# EAGLE design podule_2040 (EAGLE 9.4.2)
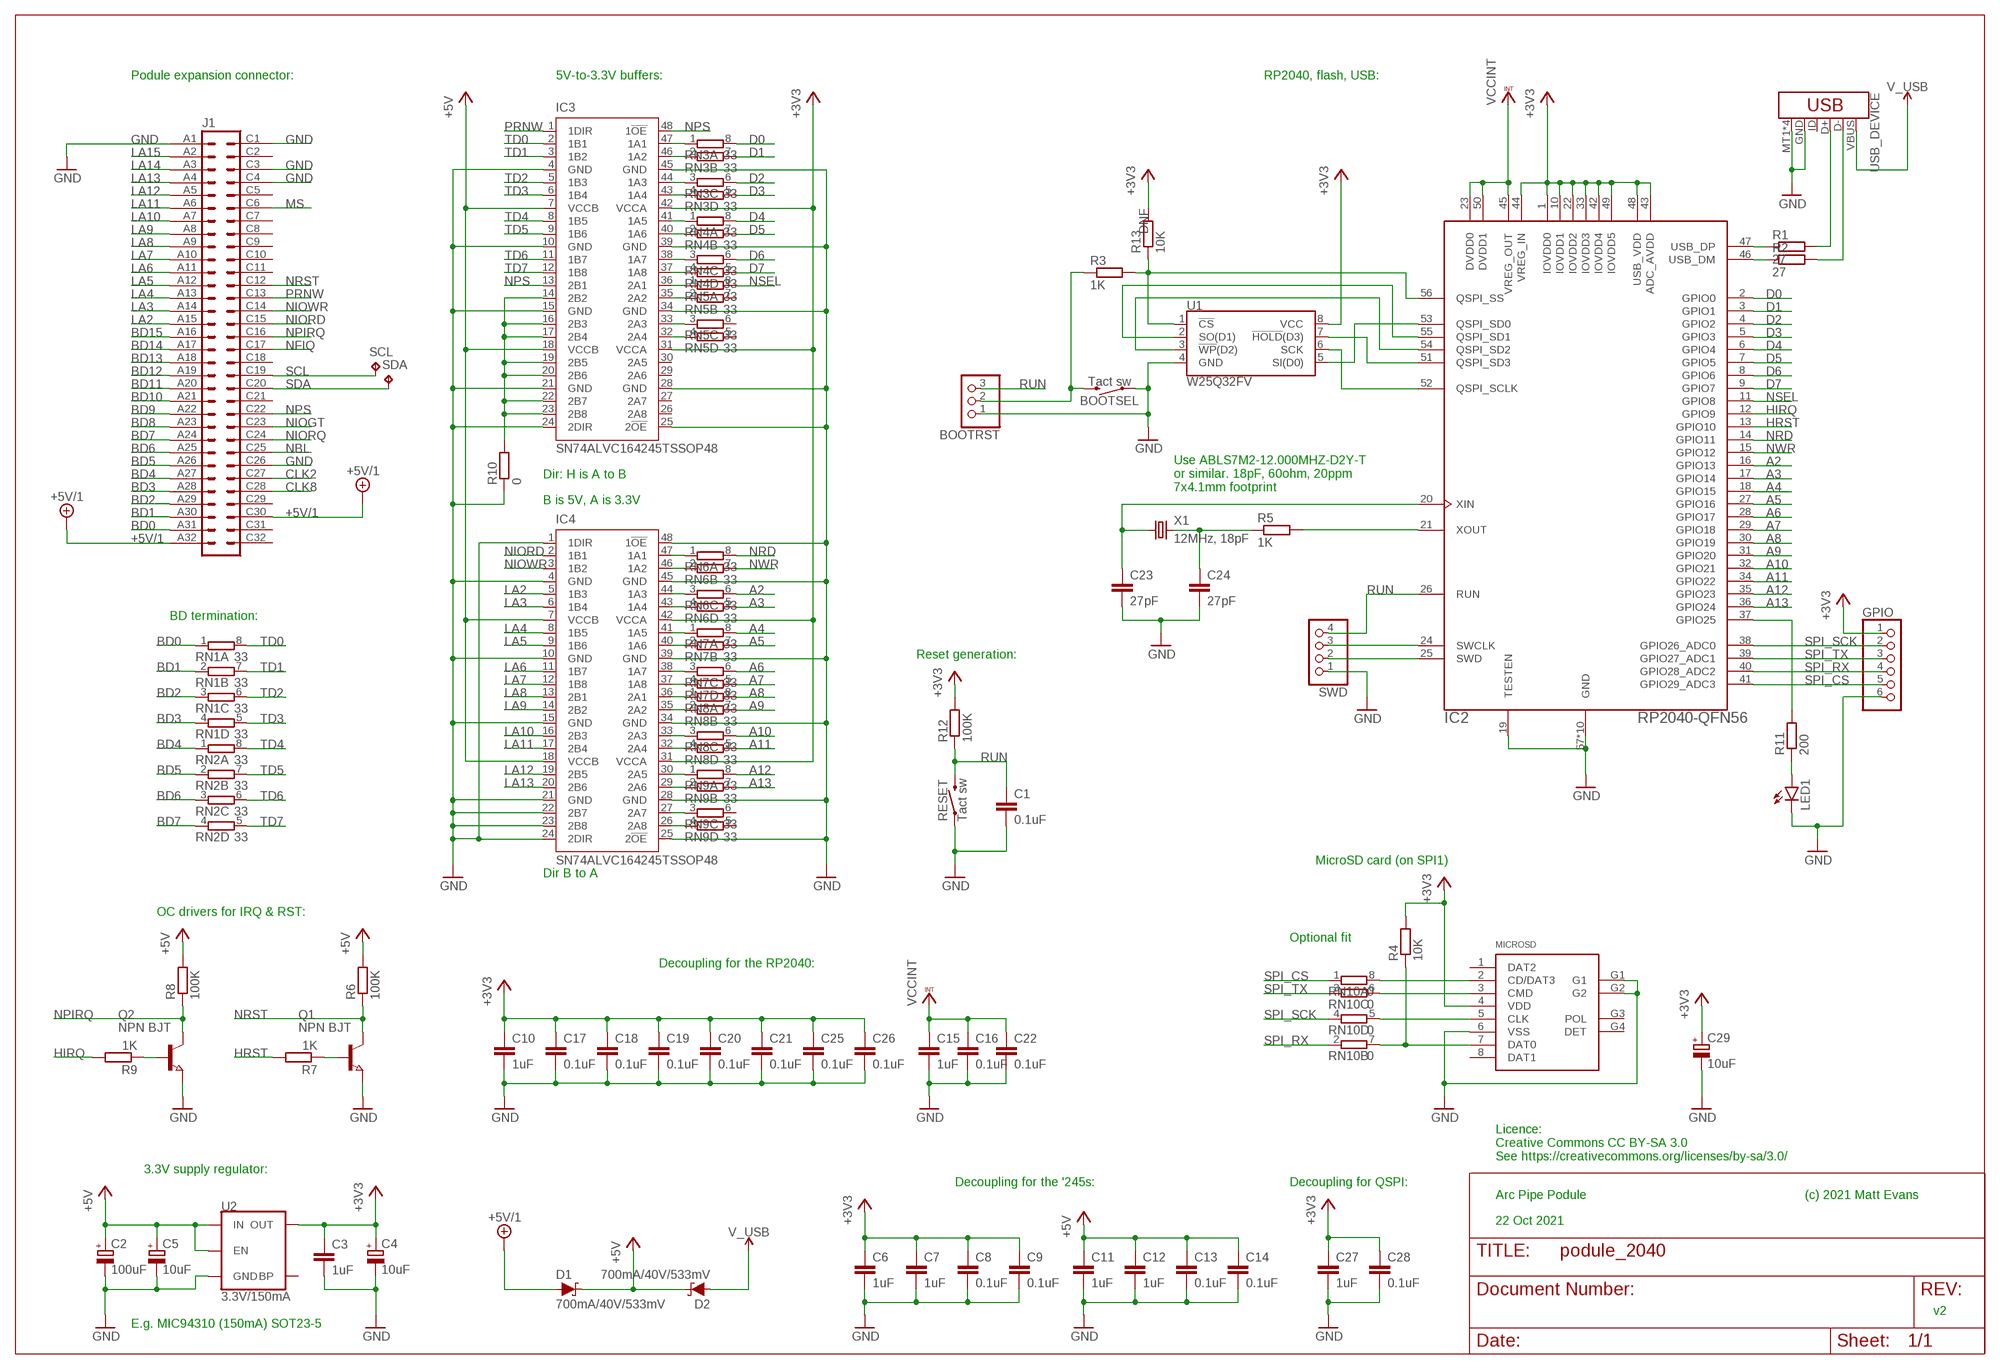
[diagram p0: schematic, sheet 1]

## Parts
BOOTRST  PINHD-1X3  [1X03]
BOOTSEL  Tact sw  MOMENTARY-SWITCH-SPST-SMD-5.2-REDUNDANT  [TACTILE_SWITCH_SMD_5.2MM]
C1  0.1uF  C-EUC0603K  [C0603K]
C2  100uF  CPOL-EUCT6032  [CT6032]
C3  1uF  C-EUC0603K  [C0603K]
C4  10uF  CPOL-EUA/3216-18W  [A/3216-18W]
C5  10uF  CPOL-EUA/3216-18W  [A/3216-18W]
C6  1uF  C-EUC0603K  [C0603K]
C7  1uF  C-EUC0603K  [C0603K]
C8  0.1uF  C-EUC0603K  [C0603K]
C9  0.1uF  C-EUC0603K  [C0603K]
C10  1uF  C-EUC0603K  [C0603K]
C11  1uF  C-EUC0603K  [C0603K]
C12  1uF  C-EUC0603K  [C0603K]
C13  0.1uF  C-EUC0603K  [C0603K]
C14  0.1uF  C-EUC0603K  [C0603K]
C15  1uF  C-EUC0603K  [C0603K]
C16  0.1uF  C-EUC0603K  [C0603K]
C17  0.1uF  C-EUC0603K  [C0603K]
C18  0.1uF  C-EUC0603K  [C0603K]
C19  0.1uF  C-EUC0603K  [C0603K]
C20  0.1uF  C-EUC0603K  [C0603K]
C21  0.1uF  C-EUC0603K  [C0603K]
C22  0.1uF  C-EUC0603K  [C0603K]
C23  27pF  C-EUC0603K  [C0603K]
C24  27pF  C-EUC0603K  [C0603K]
C25  0.1uF  C-EUC0603K  [C0603K]
C26  0.1uF  C-EUC0603K  [C0603K]
C27  1uF  C-EUC0603K  [C0603K]
C28  0.1uF  C-EUC0603K  [C0603K]
C29  10uF  CPOL-EUA/3216-18W  [A/3216-18W]
D1  700mA/40V/533mV  DIODE-SCHOTTKY-ZLLS500  [SOT23-3]
D2  700mA/40V/533mV  DIODE-SCHOTTKY-ZLLS500  [SOT23-3]
GPIO  PINHD-1X6  [1X06]
IC2  RP2040-QFN56  [RP2040-QFN-56]
IC3  SN74ALVC164245TSSOP48  [TSSOP48]
IC4  SN74ALVC164245TSSOP48  [TSSOP48]
J1  VG64SHORT  [VG64KB-80MM]
LED1  LEDCHIPLED_1206  [CHIPLED_1206]
MICROSD  MOLEX-USD-47309  [MOLEX-USD-47309]
Q1  NPN BJT  NPN-TRANSISTOR_SOT23  [SOT23]
Q2  NPN BJT  NPN-TRANSISTOR_SOT23  [SOT23]
R1  27  R-EU_R0805  [R0805]
R2  27  R-EU_R0805  [R0805]
R3  1K  R-EU_R0805  [R0805]
R4  10K  R-EU_R0805  [R0805]
R5  1K  R-EU_R0805  [R0805]
R6  100K  R-EU_R0805  [R0805]
R7  1K  R-EU_R0805  [R0805]
R8  100K  R-EU_R0805  [R0805]
R9  1K  R-EU_R0805  [R0805]
R10  0  R-EU_R0603  [R0603]
R11  200  R-EU_R0805  [R0805]
R12  100K  R-EU_R0805  [R0805]
R13  10K  R-EU_R0805  [R0805]
RESET  Tact sw  MOMENTARY-SWITCH-SPST-SMD-5.2-REDUNDANT  [TACTILE_SWITCH_SMD_5.2MM]
RN1  33  4R-N0603-ARC  [0603-ARC]
RN2  33  4R-N0603-ARC  [0603-ARC]
RN3  33  4R-N0603-ARC  [0603-ARC]
RN4  33  4R-N0603-ARC  [0603-ARC]
RN5  33  4R-N0603-ARC  [0603-ARC]
RN6  33  4R-N0603-ARC  [0603-ARC]
RN7  33  4R-N0603-ARC  [0603-ARC]
RN8  33  4R-N0603-ARC  [0603-ARC]
RN9  33  4R-N0603-ARC  [0603-ARC]
RN10  0  4R-N0603-ARC  [0603-ARC]
SCL  TPTP15R  [TP15R]
SDA  TPTP15R  [TP15R]
SWD  PINHD-1X4  [1X04]
U1  W25Q32FV  W25Q32FVSS  [SOIC-8]
U2  3.3V/150mA  V_REG_MIC52053.3V  [SOT23-5]
USB_DEVICE  USB_MICRO-B_SMT  [USB-MICROB]
X1  12MHz, 18pF  CRYSTALS-NOGND-12SMX-A  [7.5X5-2-PAD]

## Nets
+3V3: C3.1 C4.+ C6.1 C7.1 C8.1 C9.1 C10.1 C17.1 C18.1 C19.1 C20.1 C21.1 C25.1 C26.1 C27.1 C28.1 C29.+ GPIO.1 IC2.1(IOVDD0) IC2.10(IOVDD1) IC2.22(IOVDD2) IC2.33(IOVDD3) IC2.42(IOVDD4) IC2.43(ADC_AVDD) IC2.44(VREG_IN) IC2.48(USB_VDD) IC2.49(IOVDD5) IC3.31(VCCA) IC3.42(VCCA) IC4.31(VCCA) IC4.42(VCCA) MICROSD.4(VDD) R4.2 R12.2 R13.2 U1.8(VCC) U2.5(OUT)
+5V: C2.+ C5.+ C11.1 C12.1 C13.1 C14.1 D1.3(C) D2.3(C) IC3.7(VCCB) IC3.18(VCCB) IC4.7(VCCB) IC4.18(VCCB) R6.2 R8.2 U2.1(IN) U2.3(EN)
+5V/1: D1.1(A) J1.A32 J1.C30
A2: IC2.16(GPIO13) RN6.6
A3: IC2.17(GPIO14) RN6.5
A4: IC2.18(GPIO15) RN7.8
A5: IC2.27(GPIO16) RN7.7
A6: IC2.28(GPIO17) RN7.6
A7: IC2.29(GPIO18) RN7.5
A8: IC2.30(GPIO19) RN8.8
A9: IC2.31(GPIO20) RN8.7
A10: IC2.32(GPIO21) RN8.6
A11: IC2.34(GPIO22) RN8.5
A12: IC2.35(GPIO23) RN9.8
A13: IC2.36(GPIO24) RN9.7
BD0: J1.A31 RN1.1
BD1: J1.A30 RN1.2
BD2: J1.A29 RN1.3
BD3: J1.A28 RN1.4
BD4: J1.A27 RN2.1
BD5: J1.A26 RN2.2
BD6: J1.A25 RN2.3
BD7: J1.A24 RN2.4
BD8: J1.A23
BD9: J1.A22
BD10: J1.A21
BD11: J1.A20
BD12: J1.A19
BD13: J1.A18
BD14: J1.A17
BD15: J1.A16
CLK2: J1.C27
CLK8: J1.C28
D0: IC2.2(GPIO0) RN3.8
D1: IC2.3(GPIO1) RN3.7
D2: IC2.4(GPIO2) RN3.6
D3: IC2.5(GPIO3) RN3.5
D4: IC2.6(GPIO4) RN4.8
D5: IC2.7(GPIO5) RN4.7
D6: IC2.8(GPIO6) RN4.6
D7: IC2.9(GPIO7) RN4.5
GND: BOOTRST.1 BOOTSEL.1 BOOTSEL.2 C1.2 C2.- C3.2 C4.- C5.- C6.2 C7.2 C8.2 C9.2 C10.2 C11.2 C12.2 C13.2 C14.2 C15.2 C16.2 C17.2 C18.2 C19.2 C20.2 C21.2 C22.2 C23.2 C24.2 C25.2 C26.2 C27.2 C28.2 C29.- GPIO.6 IC2.19(TESTEN) IC2.57(GND) IC2.58(GND) IC2.59(GND) IC2.60(GND) IC2.61(GND) IC2.62(GND) IC2.63(GND) IC2.64(GND) IC2.65(GND) IC2.66(GND) IC3.4(GND) IC3.10(GND) IC3.15(GND) IC3.21(GND) IC3.24(2DIR) IC3.25(2!OE) IC3.28(GND) IC3.34(GND) IC3.39(GND) IC3.45(GND) IC4.1(1DIR) IC4.4(GND) IC4.10(GND) IC4.15(GND) IC4.21(GND) IC4.22(2B7) IC4.23(2B8) IC4.24(2DIR) IC4.25(2!OE) IC4.28(GND) IC4.34(GND) IC4.39(GND) IC4.45(GND) IC4.48(1!OE) J1.A1 J1.C1 J1.C3 J1.C4 J1.C26 LED1.C MICROSD.6(VSS) MICROSD.G1 MICROSD.G2 Q1.2(E) Q2.2(E) R10.1 RESET.1 RESET.2 SWD.1 U1.4(GND) U2.2(GND) USB_DEVICE.GND USB_DEVICE.MT1(SHIELD) USB_DEVICE.MT2(SHIELD) USB_DEVICE.P$1(SHIELD) USB_DEVICE.P$2(SHIELD)
HIRQ: IC2.12(GPIO9) R9.2
HRST: IC2.13(GPIO10) R7.2
LA2: IC4.5(1B3) J1.A15
LA3: IC4.6(1B4) J1.A14
LA4: IC4.8(1B5) J1.A13
LA5: IC4.9(1B6) J1.A12
LA6: IC4.11(1B7) J1.A11
LA7: IC4.12(1B8) J1.A10
LA8: IC4.13(2B1) J1.A9
LA9: IC4.14(2B2) J1.A8
LA10: IC4.16(2B3) J1.A7
LA11: IC4.17(2B4) J1.A6
LA12: IC4.19(2B5) J1.A5
LA13: IC4.20(2B6) J1.A4
LA14: J1.A3
LA15: J1.A2
MS: J1.C6
N$1: IC2.47(USB_DP) R1.1
N$2: IC2.46(USB_DM) R2.1
N$3: R1.2 USB_DEVICE.D+
N$4: R2.2 USB_DEVICE.D-
N$5: IC2.52(QSPI_SCLK) U1.6(SCK)
N$6: IC2.53(QSPI_SD0) U1.5(SI(D0))
N$7: IC2.51(QSPI_SD3) U1.7(!HOLD!(D3))
N$8: IC2.54(QSPI_SD2) U1.3(!WP!(D2))
N$9: IC2.55(QSPI_SD1) U1.2(SO(D1))
N$10: MICROSD.5(CLK) RN10.5
N$11: IC2.56(QSPI_SS) R3.2 R13.1 U1.1(!CS!)
N$12: BOOTRST.2 BOOTSEL.3 BOOTSEL.4 R3.1
N$13: IC2.21(XOUT) R5.2
N$14: MICROSD.2(CD/DAT3) RN10.8
N$15: IC2.25(SWD) SWD.2
N$16: IC2.24(SWCLK) SWD.3
N$17: C24.1 R5.1 X1.2
N$18: Q1.1(B) R7.1
N$19: C23.1 IC2.20(XIN) X1.1
N$20: Q2.1(B) R9.1
N$21: IC3.47(1A1) RN3.1
N$22: IC3.14(2B2) IC3.16(2B3) IC3.17(2B4) IC3.19(2B5) IC3.20(2B6) IC3.22(2B7) IC3.23(2B8) R10.2
N$23: MICROSD.3(CMD) RN10.6
N$24: MICROSD.7(DAT0) R4.1 RN10.7
N$26: LED1.A R11.1
N$27: IC3.46(1A2) RN3.2
N$28: IC2.37(GPIO25) R11.2
N$29: IC3.32(2A4) RN5.4
N$30: IC3.44(1A3) RN3.3
N$31: IC3.43(1A4) RN3.4
N$32: IC3.40(1A6) RN4.2
N$33: IC3.41(1A5) RN4.1
N$34: IC3.38(1A7) RN4.3
N$35: IC3.37(1A8) RN4.4
N$36: IC3.36(2A1) RN5.1
N$37: IC3.35(2A2) RN5.2
N$38: IC3.33(2A3) RN5.3
N$39: IC4.47(1A1) RN6.1
N$40: IC4.46(1A2) RN6.2
N$41: IC4.44(1A3) RN6.3
N$42: IC4.43(1A4) RN6.4
N$43: IC4.41(1A5) RN7.1
N$44: IC4.40(1A6) RN7.2
N$45: IC4.38(1A7) RN7.3
N$46: IC4.37(1A8) RN7.4
N$47: IC4.36(2A1) RN8.1
N$48: IC4.35(2A2) RN8.2
N$49: IC4.33(2A3) RN8.3
N$50: IC4.32(2A4) RN8.4
N$51: IC4.30(2A5) RN9.1
N$52: IC4.29(2A6) RN9.2
N$53: IC4.27(2A7) RN9.3
N$54: IC4.26(2A8) RN9.4
NBL: J1.C25
NFIQ: J1.C17
NIOGT: J1.C23
NIORD: IC4.2(1B1) J1.C15
NIORQ: J1.C24
NIOWR: IC4.3(1B2) J1.C14
NPIRQ: J1.C16 Q2.3(C) R8.1
NPS: IC3.13(2B1) IC3.48(1!OE) J1.C22
NRD: IC2.14(GPIO11) RN6.8
NRST: J1.C12 Q1.3(C) R6.1
NSEL: IC2.11(GPIO8) RN5.8
NWR: IC2.15(GPIO12) RN6.7
PRNW: IC3.1(1DIR) J1.C13
RUN: BOOTRST.3 C1.1 IC2.26(RUN) R12.1 RESET.3 RESET.4 SWD.4
SCL: J1.C19 SCL.TP
SDA: J1.C20 SDA.TP
SPI_CS: GPIO.5 IC2.41(GPIO29_ADC3) RN10.1
SPI_RX: GPIO.4 IC2.40(GPIO28_ADC2) RN10.2
SPI_SCK: GPIO.2 IC2.38(GPIO26_ADC0) RN10.4
SPI_TX: GPIO.3 IC2.39(GPIO27_ADC1) RN10.3
TD0: IC3.2(1B1) RN1.8
TD1: IC3.3(1B2) RN1.7
TD2: IC3.5(1B3) RN1.6
TD3: IC3.6(1B4) RN1.5
TD4: IC3.8(1B5) RN2.8
TD5: IC3.9(1B6) RN2.7
TD6: IC3.11(1B7) RN2.6
TD7: IC3.12(1B8) RN2.5
V_USB: D2.1(A) USB_DEVICE.VBUS
VCCINT: C15.1 C16.1 C22.1 IC2.23(DVDD0) IC2.45(VREG_OUT) IC2.50(DVDD1)
Unconnected: IC3.26(2A8) IC3.27(2A7) IC3.29(2A6) IC3.30(2A5) J1.C2 J1.C5 J1.C7 J1.C8 J1.C9 J1.C10 J1.C11 J1.C18 J1.C21 J1.C29 J1.C31 J1.C32 MICROSD.1(DAT2) MICROSD.8(DAT1) MICROSD.G3(POL) MICROSD.G4(DET) RN5.5 RN5.6 RN5.7 RN9.5 RN9.6 U2.4(BP) USB_DEVICE.ID

## Notes on the sheet
- Podule expansion connector: | 5V-to-3.3V buffers: | RP2040, flash, USB:
- Dir: H is A to B
- Use ABLS7M2-12.000MHZ-D2Y-T
  or similar. 18pF, 60ohm, 20ppm
  7x4.1mm footprint
- B is 5V, A is 3.3V
- BD termination:
- Reset generation:
- MicroSD card (on SPI1)
- Dir B to A
- OC drivers for IRQ & RST:
- Optional fit
- Decoupling for the RP2040:
- Licence:
  Creative Commons CC BY-SA 3.0
  See https://creativecommons.org/licenses/by-sa/3.0/
- 3.3V supply regulator:
- Decoupling for the '245s: | Decoupling for QSPI:
- Arc Pipe Podule | (c) 2021 Matt Evans
- 22 Oct 2021
- v2
- E.g. MIC94310 (150mA) SOT23-5

## Library data of the parts
BOOTRST = matt:PINHD-1X3: PIN HEADER
BOOTSEL RESET = SparkFun-Switches:MOMENTARY-SWITCH-SPST: Momentary Switch (Pushbutton) - SPST Normally-open (NO) SPST momentary switches (buttons, pushbuttons). Variants PTH-12MM - 12mm square, through-hole Momentary Pushbutton Switch - 12mm Square <https://www.sparkfun.com/products/9190> (COM-09190) PTH-6.0MM, PTH-6.0MM-KIT - 6.0mm square, through-hole Mini Pushbutton Switch <https://www.sparkfun.com/products/97> (COM-00097) KIT package intended for soldering kit's - only one side of pads' copper is exposed. PTH-RIGHT-ANGLE-KIT - Right-angle, through-hole Right Angle Tactile Button <https://www.sparkfun.com/products/10791> - Used on SparkFun BigTime Watch Kit <https://www.sparkfun.com/products/11734> SMD-12MM - 12mm square, surface-mount Tactile Button - SMD (12mm) <https://www.sparkfun.com/products/12993> (COM-12993) Used on SparkFun PicoBoard <https://www.sparkfun.com/products/11888> SMD-4.5MM - 4.5mm Square Trackball Switch Used on SparkFun Blackberry Trackballer Breakout <https://www.sparkfun.com/products/13169> SMD-4.6MMX2.8MM - 4.60mm x 2.80mm, surface mount Used on SparkFun SAMD21 Mini Breakout <https://www.sparkfun.com/products/13664> SMD-5.2MM, SMD-5.2-REDUNDANT - 5.2mm square, surface-mount Mini Pushbutton Switch - SMD <https://www.sparkfun.com/products/8720> (COM-08720) Used on Arduino Pro Mini <https://www.sparkfun.com/products/11114> REDUNDANT package connects both switch circuits together SMD-6.0X3.5MM - 6.0 x 3.5mm, surface mount Momentary Reset Switch SMD <https://www.sparkfun.com/products/8229> (COM-08229) SMD-6.2MM-TALL - 6.2mm square, surface mount Tactile Button - SMD (6mm) <https://www.sparkfun.com/products/12992> Used on SparkFun Digital Sandbox <https://www.sparkfun.com/products/12651> SMD-RIGHT-ANGLE - Right-angle, surface mount Used on SparkFun Block for Intel® Edison - Arduino <https://www.sparkfun.com/products/13036>; PROD_ID: SWCH-08247; SF_SKU: COM-08720
C1 C3 C6-C28 = rcl:C-EU: CAPACITOR, European symbol; SPICEPREFIX: C
C2 C4 C5 C29 = rcl:CPOL-EU: POLARIZED CAPACITOR, European symbol; SPICEPREFIX: C
D1 D2 = SparkFun-DiscreteSemi:DIODE-SCHOTTKY: Schottky diode A Schottky diode is a semiconductor diode which has a low forward voltage drop and a very fast switching action.; PROD_ID: DIO-08411
GPIO = matt:PINHD-1X6: PIN HEADER
IC2 = RpiPico:RP2040-QFN56
IC3 IC4 = matt:SN74ALVC164245: 16-BIT BUS TRANSCEIVER WITH 3-STATE OUTPUTS Auto generated by make-symbol-device-package-bsdl.ulp Rev. 33 Source: http://focus.ti.com/lit/ds/symlink/sn74lvcr162245.pdf
J1 = matt:VG64: PCB EUROCARD, 64-pin type C/AC, 2.54 mm
LED1 = led:LED: LED OSRAM: - CHIPLED LG R971, LG N971, LY N971, LG Q971, LY Q971, LO R971, LY R971 LH N974, LH R974 LS Q976, LO Q976, LY Q976 LO Q996 - Hyper CHIPLED LW Q18S LB Q993, LB Q99A, LB R99A - SideLED LS A670, LO A670, LY A670, LG A670, LP A670 LB A673, LV A673, LT A673, LW A673 LH A674 LY A675 LS A676, LA A676, LO A676, LY A676, LW A676 LS A679, LY A679, LG A679 - Hyper Micro SIDELED® LS Y876, LA Y876, LO Y876, LY Y876 LT Y87S - SmartLED LW L88C, LW L88S LB L89C, LB L89S, LG L890 LS L89K, LO L89K, LY L89K LS L896, LA L896, LO L896, LY L896 - TOPLED LS T670, LO T670, LY T670, LG T670, LP T670 LSG T670, LSP T670, LSY T670, LOP T670, LYG T670 LG T671, LOG T671, LSG T671 LB T673, LV T673, LT T673, LW T673 LH T674 LS T676, LA T676, LO T676, LY T676, LB T676, LH T676, LSB T676, LW T676 LB T67C, LV T67C, LT T67C, LS T67K, LO T67K, LY T67K, LW E67C LS E67B, LA E67B, LO E67B, LY E67B, LB E67C, LV E67C, LT E67C LW T67C LS T679, LY T679, LG T679 LS T770, LO T770, LY T770, LG T770, LP T770 LB T773, LV T773, LT T773, LW T773 LH T774 LS E675, LA E675, LY E675, LS T675 LS T776, LA T776, LO T776, LY T776, LB T776 LHGB T686 LT T68C, LB T68C - Hyper Mini TOPLED® LB M676 - Mini TOPLED Santana® LG M470 LS M47K, LO M47K, LY M47K Source: http://www.osram.convergy.de LUXEON: - LUMILED® LXK2-PW12-R00, LXK2-PW12-S00, LXK2-PW14-U00, LXK2-PW14-V00 LXK2-PM12-R00, LXK2-PM12-S00, LXK2-PM14-U00 LXK2-PE12-Q00, LXK2-PE12-R00, LXK2-PE12-S00, LXK2-PE14-T00, LXK2-PE14-U00 LXK2-PB12-K00, LXK2-PB12-L00, LXK2-PB12-M00, LXK2-PB14-N00, LXK2-PB14-P00, LXK2-PB14-Q00 LXK2-PR12-L00, LXK2-PR12-M00, LXK2-PR14-Q00, LXK2-PR14-R00 LXK2-PD12-Q00, LXK2-PD12-R00, LXK2-PD12-S00 LXK2-PH12-R00, LXK2-PH12-S00 LXK2-PL12-P00, LXK2-PL12-Q00, LXK2-PL12-R00 Source: www.luxeon.com KINGBRIGHT: KA-3528ASYC Source: www.kingbright.com
MICROSD = matt:MOLEX-USD-47309: Molex Micro-SD connector series 47309
Q1 Q2 = semicon-smd-ipc:NPN-TRANSISTOR_: NPN TRANSISTOR
R1-R12 = rcl:R-EU_: RESISTOR, European symbol; SPICEPREFIX: R
R13 = rcl:R-EU_: RESISTOR, European symbol; DNF: True; SPICEPREFIX: R
RN1-RN10 = resistor-dil:4R-N: Array Chip Resistor Source: RS Component / Phycomp; OC_FARNELL: unknown; OC_NEWARK: unknown
SCL SDA = testpad:TP: Test pad
SWD = matt:PINHD-1X4: PIN HEADER
U1 = SparkFun-IC-Memory:W25Q32FV: W25Q32FV 32Mb (4MB) Serial Flash Memory The W25Q32FV support the standard Serial Peripheral Interface (SPI), Dual/Quad I/O SPI as well as 2-clocks instruction cycle Quad Peripheral Interface (QPI). 104MHz, SPI, 8-SOIC-EIAJ Datasheet <http://www.winbond.com/resource-files/w25q32fv%20revh%20091613.pdf> SparkFun Products SparkFun Blynk Board - ESP8266 <https://www.sparkfun.com/products/13794> (WRL-13794); PROD_ID: IC-13229
U2 = SparkFun-IC-Power:V_REG_MIC5205: V_REG MIC5205 Standard 3.3V, 5V, and Adjustable 150mA LDO voltage regulator in SOT-23 layout. Micrel part MIC5205. BP (by-pass) pin is used to lower output noise with 470pF cap, may be left open. On the adjustable version BP is used to set output.; PROD_ID: VREG-00822
USB_DEVICE = SparkFun-Connectors:USB_MICRO-B: USB Type Micro-B Connector Male/female and PTH/SMT variants SparkFun Products: SparkFun microB USB Breakout <https://www.sparkfun.com/products/12035> SparkFun USB microB Plug Breakout <https://www.sparkfun.com/products/10031> SparkFun ESP8266 Thing <https://www.sparkfun.com/products/13231>; PROD_ID: CONN-09505; SF_ID: PRT-08533
X1 = IQD-Frequency-Products:CRYSTALS-NOGND: CRYSTALS CAN NOT GROUNDED

## Board
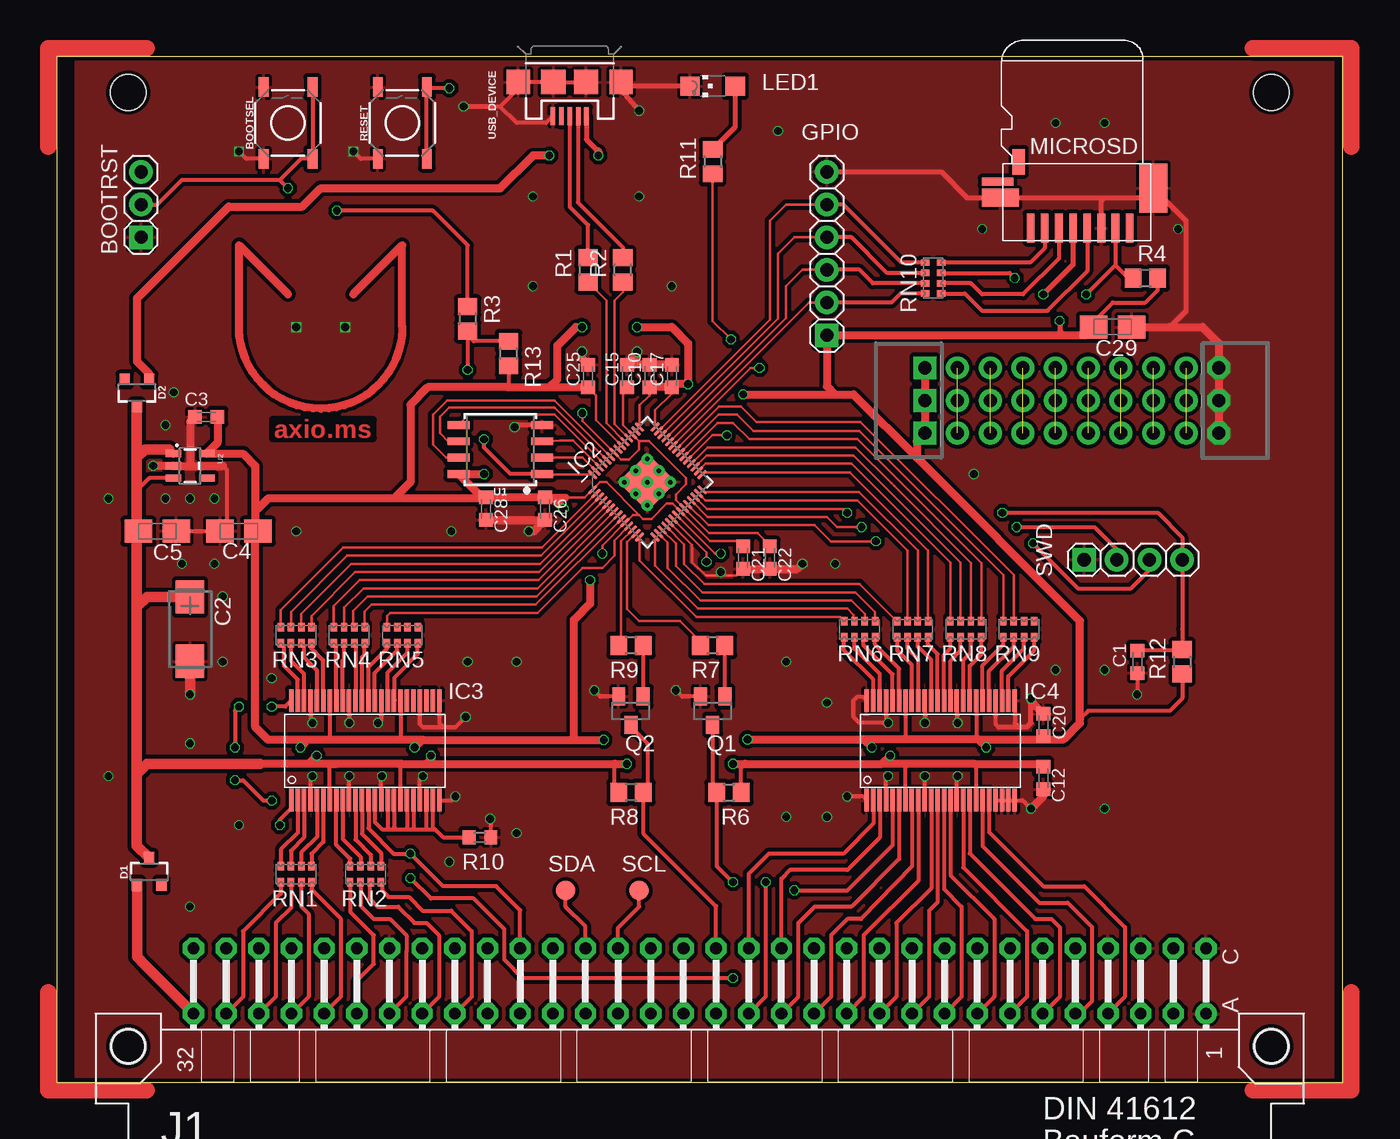
[diagram p1: board, top side]
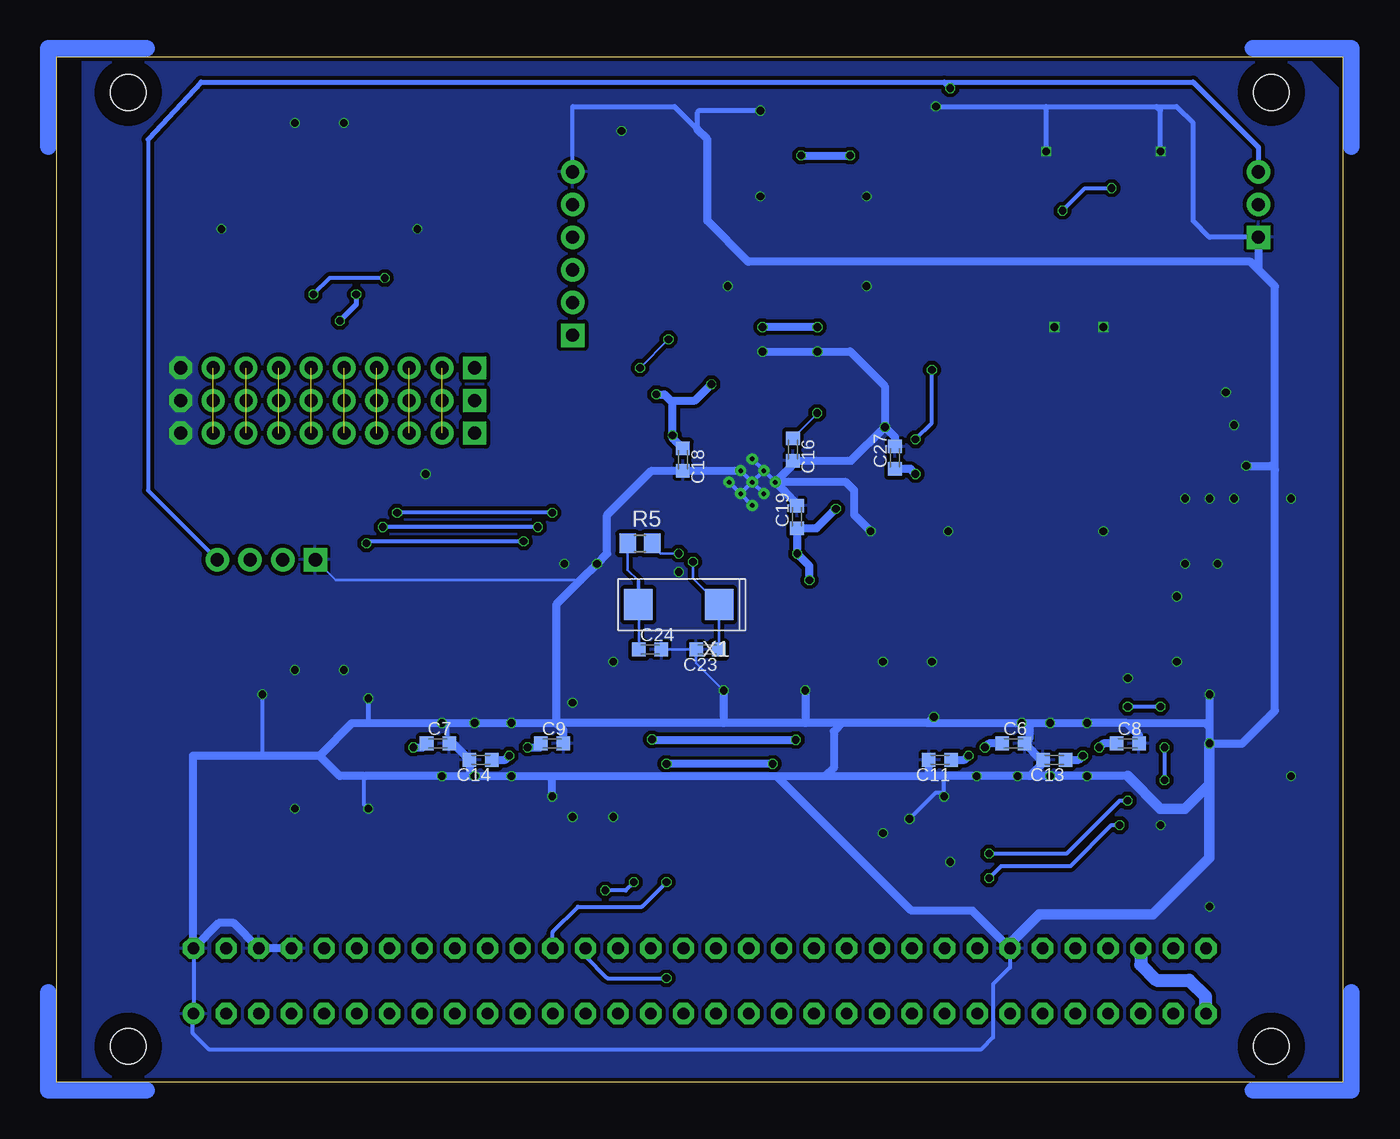
[diagram p2: board, bottom side, seen from below]

Size 100.03 x 79.76 mm. Coordinates in mm from the lower left corner, seen from the top.
Copper layers (1*16): Top 0.035mm / dielectric 1.6mm / Bottom 0.035mm
Design rules "jlcpcb-2layers": minimum track width 5mil, minimum drill 0.3mm, track to track 5mil, track to pad 5mil, pad to pad 5mil, via to via 5mil, smd to smd 5mil, copper to edge 0.2mm, drill to drill 6mil, minimum pad ring 10mil, minimum via ring 3mil, stop-mask expansion 4mil, vias tented up to drill 0mil, thermal gap 10mil

### Footprints (pad centres in the part's own frame; a part is rotated, then mirrored left to right if it is on the bottom)
1X03 = drill 1.016 square: 1 -2.54,0 | drill 1.016 pad 1.676: 2 0,0; 3 2.54,0
TACTILE_SWITCH_SMD_5.2MM = smd 1.524 x 0.762: 1 -2.794,1.905; 2 2.794,1.905; 3 -2.794,-1.905; 4 2.794,-1.905
C0603K = smd 1.05 x 1.08: 1 -0.875,0; 2 0.875,0
CT6032 = smd 2.6 x 2.2: + -2.5,0; - 2.5,0
A/3216-18W = smd 2.15 x 1.8: + 1.475,0; - -1.475,0
SOT23-3 = smd 0.8 x 0.9: 1 -0.95,-1; 2 0.95,-1; 3 0,1.1
1X06 = drill 1.016 square: 1 -6.35,0 | drill 1.016 pad 1.676: 2 -3.81,0; 3 -1.27,0; 4 1.27,0; 5 3.81,0; 6 6.35,0
RP2040-QFN-56 = smd 0.875 x 0.2: 1 -3.438,2.6; 2 -3.438,2.2; 3 -3.438,1.8; 4 -3.438,1.4; 5 -3.438,1; 6 -3.438,0.6; 7 -3.438,0.2; 8 -3.438,-0.2; 9 -3.438,-0.6; 10 -3.438,-1; 11 -3.438,-1.4; 12 -3.438,-1.8; 13 -3.438,-2.2; 14 -3.438,-2.6; 29 3.438,-2.6; 30 3.438,-2.2; 31 3.438,-1.8; 32 3.438,-1.4; 33 3.438,-1; 34 3.438,-0.6; 35 3.438,-0.2; 36 3.438,0.2; 37 3.438,0.6; 38 3.438,1; 39 3.438,1.4; 40 3.438,1.8; 41 3.438,2.2; 42 3.438,2.6 | smd 0.2 x 0.875: 15 -2.6,-3.438; 16 -2.2,-3.438; 17 -1.8,-3.438; 18 -1.4,-3.438; 19 -1,-3.438; 20 -0.6,-3.438; 21 -0.2,-3.438; 22 0.2,-3.438; 23 0.6,-3.438; 24 1,-3.438; 25 1.4,-3.438; 26 1.8,-3.438; 27 2.2,-3.438; 28 2.6,-3.438; 43 2.6,3.438; 44 2.2,3.438; 45 1.8,3.438; 46 1.4,3.438; 47 1,3.438; 48 0.6,3.438; 49 0.2,3.438; 50 -0.2,3.438; 51 -0.6,3.438; 52 -1,3.438; 53 -1.4,3.438; 54 -1.8,3.438; 55 -2.2,3.438; 56 -2.6,3.438 | smd 3.2 x 3.2: 57 0,0 | drill 0.35 pad 0.6: 58 -1.275,1.275; 59 0,1.275; 60 1.275,1.275; 61 -1.275,0; 62 0,0; 63 1.275,0; 64 -1.275,-1.275; 65 0,-1.275; 66 1.275,-1.275
TSSOP48 = smd 0.35 x 1.75: 1 -6.1,-1.25; 2 -5.6,-1.25; 3 -5.1,-1.25; 4 -4.6,-1.25; 5 -4.1,-1.25; 6 -3.6,-1.25; 7 -3.1,-1.25; 8 -2.6,-1.25; 9 -2.1,-1.25; 10 -1.6,-1.25; 11 -1.1,-1.25; 12 -0.6,-1.25; 13 -0.1,-1.25; 14 0.4,-1.25; 15 0.9,-1.25; 16 1.4,-1.25; 17 1.9,-1.25; 18 2.4,-1.25; 19 2.9,-1.25; 20 3.4,-1.25; 21 3.9,-1.25; 22 4.4,-1.25; 23 4.9,-1.25; 24 5.4,-1.25; 25 5.4,6.5; 26 4.9,6.5; 27 4.4,6.5; 28 3.9,6.5; 29 3.4,6.5; 30 2.9,6.5; 31 2.4,6.5; 32 1.9,6.5; 33 1.4,6.5; 34 0.9,6.5; 35 0.4,6.5; 36 -0.1,6.5; 37 -0.6,6.5; 38 -1.1,6.5; 39 -1.6,6.5; 40 -2.1,6.5; 41 -2.6,6.5; 42 -3.1,6.5; 43 -3.6,6.5; 44 -4.1,6.5; 45 -4.6,6.5; 46 -5.1,6.5; 47 -5.6,6.5; 48 -6.1,6.5
VG64KB-80MM = drill 0.914 pad 1.6: A1 95.94,90.44 | drill 0.914 pad 1.6 octagon: A2 95.94,87.9; A3 95.94,85.36; A4 95.94,82.82; A5 95.94,80.28; A6 95.94,77.74; A7 95.94,75.2; A8 95.94,72.66; A9 95.94,70.12; A10 95.94,67.58; A11 95.94,65.04; A12 95.94,62.5; A13 95.94,59.96; A14 95.94,57.42; A15 95.94,54.88; A16 95.94,52.34; A17 95.94,49.8; A18 95.94,47.26; A19 95.94,44.72; A20 95.94,42.18; A21 95.94,39.64; A22 95.94,37.1; A23 95.94,34.56; A24 95.94,32.02; A25 95.94,29.48; A26 95.94,26.94; A27 95.94,24.4; A28 95.94,21.86; A29 95.94,19.32; A30 95.94,16.78; A31 95.94,14.24; A32 95.94,11.7; C1 90.86,90.44; C2 90.86,87.9; C3 90.86,85.36; C4 90.86,82.82; C5 90.86,80.28; C6 90.86,77.74; C7 90.86,75.2; C8 90.86,72.66; C9 90.86,70.12; C10 90.86,67.58; C11 90.86,65.04; C12 90.86,62.5; C13 90.86,59.96; C14 90.86,57.42; C15 90.86,54.88; C16 90.86,52.34; C17 90.86,49.8; C18 90.86,47.26; C19 90.86,44.72; C20 90.86,42.18; C21 90.86,39.64; C22 90.86,37.1; C23 90.86,34.56; C24 90.86,32.02; C25 90.86,29.48; C26 90.86,26.94; C27 90.86,24.4; C28 90.86,21.86; C29 90.86,19.32; C30 90.86,16.78; C31 90.86,14.24; C32 90.86,11.7 | hole 2.794: 98.48,95.52; 98.48,6.62; 24.31,6.62; 24.31,95.52
CHIPLED_1206 = smd 1.5 x 1.5: A 0,-1.75; C 0,1.75
MOLEX-USD-47309 = smd 0.6 x 2.25: 1 3.85,5; 2 2.75,5; 3 1.65,5; 4 0.55,5; 5 -0.55,5; 6 -1.65,5; 7 -2.75,5; 8 -3.85,5 | smd 2.2 x 3.8: G1 -5.7,1.9 | smd 2.9 x 1.4: G2 6.2,2.65 | smd 2.45 x 0.6: G3 6.425,1.4 | smd 0.95 x 2: G4 4.775,-0.15
SOT23 = smd 1 x 1.4: 1 -0.95,-1.1; 2 0.95,-1.1; 3 0,1.1
R0805 = smd 1.3 x 1.5: 1 -0.95,0; 2 0.95,0
R0603 = smd 1 x 1.1: 1 -0.85,0; 2 0.85,0
0603-ARC = smd 0.5 x 0.65: 1 -1.2,-0.625; 2 -0.4,-0.625; 3 0.4,-0.625; 4 1.2,-0.625; 5 1.2,0.625; 6 0.4,0.625; 7 -0.4,0.625; 8 -1.2,0.625
TP15R = smd 1.5 x 1.5: TP 0,0
1X04 = drill 1.016 square: 1 -3.81,0 | drill 1.016 pad 1.676: 2 -1.27,0; 3 1.27,0; 4 3.81,0
SOIC-8 = smd 0.61 x 1.702: 1 -1.905,-3.251; 2 -0.635,-3.251; 3 0.635,-3.251; 4 1.905,-3.251; 5 1.905,3.251; 6 0.635,3.251; 7 -0.635,3.251; 8 -1.905,3.251
SOT23-5 = smd 0.55 x 1.2: 1 -0.95,-1.3; 2 0,-1.3; 3 0.95,-1.3; 4 0.95,1.3; 5 -0.95,1.3
USB-MICROB = smd 1.4 x 0.35: D+ -2.65,0; D- -2.65,-0.65; GND -2.65,1.3; ID -2.65,0.65; VBUS -2.65,-1.3 | smd 1.9 x 1.8: MT1 0,-4; MT2 0,4 | smd 1.9 x 1.9: P$1 0,-1.27; P$2 0,1.27
7.5X5-2-PAD = smd 2.2 x 2.4: 1 -3.15,0; 2 3.15,0

### Placement (x,y rotation side)
BOOTRST  6.56,68.25 90 top
BOOTSEL  17.99,74.6 90 top
C1  84.03,32.69 270 top
C2  10.37,35.23 270 top
C3  11.64,51.74 180 top
C4  14.18,42.85 0 top
C5  7.83,42.85 180 top
C6  25.61,26.34 0 bottom
C7  70.38,26.34 0 bottom
C8  16.72,26.34 0 bottom
C9  61.49,26.34 0 bottom
C10  46.09,54.92 90 top
C11  31.33,25.07 180 bottom
C12  76.73,23.65 270 top
C13  22.44,25.07 180 bottom
C14  67.05,25.07 180 bottom
C15  44.35,54.92 90 top
C16  42.76,49.2 270 bottom
C17  47.84,54.92 90 top
C18  51.33,48.41 270 bottom
C19  42.44,43.97 90 bottom
C20  76.73,27.77 90 top
C21  53.39,40.79 270 top
C22  55.46,40.79 270 top
C23  49.43,33.65 180 bottom
C24  53.87,33.65 0 bottom
C25  41.33,54.92 90 top
C26  38,44.6 270 top
C27  34.82,48.57 90 bottom
C28  33.39,44.6 270 top
C29  82.13,58.73 180 top
D1  7.2,16.34 0 top
D2  6.25,53.65 180 top
GPIO  59.9,64.44 90 top
IC2  45.93,46.66 45 top
IC3  24.34,23.17 0 top
IC4  69.11,23.17 0 top
J1  -1.06,101.27 270 top
LED1  51.01,77.46 90 top
MICROSD  79.59,71.43 180 top
Q1  51.01,28.88 180 top
Q2  44.66,28.88 180 top
R1  41.33,63.17 90 top
R2  44.03,63.17 90 top
R3  31.96,59.36 270 top
R4  84.67,62.54 0 top
R5  54.66,41.9 0 bottom
R6  52.28,22.53 0 top
R7  51.01,33.96 180 top
R8  44.66,22.53 180 top
R9  44.66,33.96 180 top
R10  32.92,19.04 180 top
R11  51.01,71.59 270 top
R12  87.53,32.69 270 top
R13  35.14,56.67 270 top
RESET  26.88,74.6 90 top
RN1  18.63,16.18 0 top
RN2  24.03,16.18 0 top
RN3  18.63,34.76 0 top
RN4  22.76,34.76 0 top
RN5  26.88,34.76 0 top
RN6  62.44,35.23 0 top
RN7  66.57,35.23 0 top
RN8  70.7,35.23 0 top
RN9  74.83,35.23 0 top
RN10  68.16,62.54 270 top
SCL  45.3,14.91 0 top
SDA  39.58,14.91 0 top
SWD  83.72,40.63 0 top
U1  34.5,49.2 90 top
U2  10.37,47.93 270 top
USB_DEVICE  39.9,77.78 90 top
X1  51.65,37.14 180 bottom

### Tracks (layer width: path | path; a pad name or v marks a point on that pad's centre or on a via)
+3V3  (via drill 0.6, 1.02 pad 1.78)
  Top 0.203: IC2.49 IC2.48 41.96,51.48 41.96,53.41 C25.1 | IC2.49 | IC2.44 IC2.43 45.34,52.66 46.09,53.41 C10.1 | IC2.42 46.52,52.26 47.84,53.57 C17.1 48.08,54.28 | 39.58,45.48 41.07,45.48 IC2.1 42.26,46.66 42.76,46.66 45.3,44.12 | 33.09,45.46 C28.1 33.31,45.39 | 45.3,44.12 44.81,44.12 IC2.10 44.21,43.51 42.44,41.74 v42.44,41.11 | 45.3,44.12 45.62,43.81 46.25,43.81 47.44,45 47.88,45 IC2.22 50.79,42.09 52.97,42.09 C21.1 | v52.12,50.32 51,50.32 IC2.33
  Top 0.305: IC4.42 66.01,26.74 65.93,26.66 | IC4.31 71.51,26.8 71.65,26.66 | IC3.31 26.74,26.8 26.56,26.62 | IC3.42 21.24,26.7 21.17,26.62 | 19.26,26.62 19.26,26.34 | 28.43,26.62 28.47,26.62 | R13.2 35.14,54.04 | R4.2 85.62,61.58 84.67,60.63 82.13,60.63 80.65,59.16 | R12.2 87.52,29.84 86.57,28.88 80.22,28.88 79.59,28.25
  Top 0.406: 15.45,43.06 C4.+ 15.45,42.65 | MICROSD.4 79.04,63.58 v76.73,61.27 | v78,59.21 78,58.41 78.32,58.09 | C29.+ 80.65,59.16 | C20.1 76.49,26.66
  Top 0.584: 39.11,44.92 38.55,45.48 C26.1 39.58,45.48
  Top 0.61: 15.45,44.4 15.45,47.93 14.5,48.88 U2.5 12.52,49.73 C3.1 | 15.45,42.65 15.45,27.61 16.44,26.62 19.26,26.62 21.17,26.62 26.56,26.62 28.47,26.62 40.22,26.62 | 62.76,26.66 65.93,26.66 71.65,26.66 | v72.29,26.03 71.65,26.66 | v63.39,26.03 62.76,26.66 | 19.26,26.34 v18.95,26.03 | v27.83,26.03 28.43,26.62 | 40.22,26.62 v42.54,26.62 | v53.73,26.66 62.76,26.66 | C17.1 C10.1 | v33.23,47.3 U1.8 33.09,45.46 | C26.1 C28.1 | 48.08,54.28 v49.11,54.28 49.11,57.46 47.84,58.73 v45.14,58.73 | 40.22,26.62 40.22,35.95 41.49,37.22 v41.49,39.04 | v39.42,44.6 39.11,44.92 | 38.31,54.04 35.14,54.04 28.86,54.04 27.52,52.7 27.52,46.66 26.25,45.39 | 38.31,54.04 C25.1 | 38.31,54.04 38.95,54.68 38.95,57.3 40.38,58.73 v40.85,58.73 | 33.31,45.39 26.25,45.39 | 26.25,45.39 16.45,45.39 15.45,44.4 | 15.45,44.4 15.45,43.06 | 71.65,26.66 76.49,26.66 78.32,26.66 79.59,27.93 79.59,28.25 79.59,35.87 66.89,48.57 | C29.+ 80.02,58.09 78.32,58.09 GPIO.1 59.9,54.13 60.54,53.49 | v67.52,55.55 v67.52,53.01 v67.52,50.47 66.89,49.84 66.89,48.57 | v53.39,53.49 60.54,53.49 | 60.54,53.49 61.97,53.49 66.89,48.57
  Bottom 0.203: v52.12,50.32 52.12,50.08
  Bottom 0.305: C7.1 71.57,26.03 | C9.1 62.37,26.1 62.44,26.03
  Bottom 0.406: v76.73,61.27 76.73,60.48 v78,59.21
  Bottom 0.61: v72.29,26.03 71.57,26.03 | v63.39,26.03 62.44,26.03 | C8.1 18.63,26.34 v18.95,26.03 | C6.1 27.52,26.34 v27.83,26.03 | v53.73,26.66 53.69,26.62 v42.54,26.62 | v33.23,47.3 33.63,47.69 C27.1 | v41.49,39.04 41.49,40.16 v42.44,41.11 C19.1 40.93,43.09 v39.42,44.6 | C18.1 52.12,50.08 | v40.85,58.73 v45.14,58.73 | v49.11,54.28 50.38,53.01 52.28,53.01 | v53.39,53.49 52.76,53.49 52.28,53.01 | 52.28,53.01 52.12,52.86 v52.12,50.32
+5V  (via drill 0.6)
  Top 0.305: 66.25,24.76 66.01,24.51 IC4.7 | 71.33,24.76 71.51,24.58 IC4.18 | IC3.7 21.24,24.76 | IC3.18 26.74,24.69 26.81,24.76 | R6.2 53.23,24.44 53.55,24.76 | 43.39,24.76 43.39,22.85 R8.2 | U2.3 7.2,46.98 6.24,46.03
  Top 0.61: 64.19,24.76 66.25,24.76 71.33,24.76 76.49,24.76 C12.1 | v64.82,25.39 64.19,24.76 | 21.8,24.76 26.81,24.76 28.79,24.76 | 21.8,24.76 19.58,24.76 | 19.58,24.76 15.77,24.76 | v20.22,25.39 19.58,24.76 | 21.24,24.76 21.8,24.76 | 28.79,24.76 43.39,24.76 v44.35,24.76 | v52.6,24.76 53.55,24.76 64.19,24.76 | v29.1,25.39 29.1,25.07 28.79,24.76 | U2.1 8.75,49.2
  Top 0.813: 6.24,23.95 6.24,36.94 | 6.24,36.94 6.24,42.74 6.24,46.03 6.24,48.57 | D1.3 6.24,18.4 6.24,23.95 | 15.77,24.76 7.05,24.76 6.24,23.95 | 8.75,49.2 6.88,49.2 6.24,48.57 | D2.3 6.24,48.57 | 6.24,36.94 7.04,37.73 C2.+
  Top 1.016: 6.24,42.74 C5.+
  Bottom 0.61: C14.1 65.14,25.07 v64.82,25.39 | C13.1 20.53,25.07 v20.22,25.39 | C11.1 29.42,25.07 v29.1,25.39 | v44.35,24.76 v52.6,24.76
+5V/1
  Top 0.813: D1.1 6.25,10.47 6.25,9.73 6.88,9.1 J1.A32
  Bottom 1.016: J1.A32 10.69,5.38 10.69,6.66 11.96,7.93 14.5,7.93 15.72,9.15 J1.C30
A2
  Top 0.203: IC2.16 47.52,41.97 47.52,40 50.06,37.46 61.81,37.46 62.84,36.42 RN6.6
A3
  Top 0.203: IC2.17 48.16,41.9 48.16,40.16 50.22,38.09 62.13,38.09 63.64,36.57 RN6.5
A4
  Top 0.203: IC2.18 48.79,41.83 48.79,40.31 50.38,38.73 62.44,38.73 65.31,35.86 RN7.8
A5
  Top 0.203: IC2.27 50.47,45.24 58.64,45.24 58.65,45.25 62.27,45.25 66.17,41.35 RN7.7
A6
  Top 0.203: IC2.28 50.36,45.91 62.4,45.91 66.97,41.34 RN7.6
A7
  Top 0.203: IC2.29 50.36,47.42 61.69,47.42 67.77,41.34 RN7.5
A8
  Top 0.203: IC2.30 50.47,48.09 61.81,48.09 69.5,40.4 RN8.8
A9
  Top 0.203: IC2.31 50.54,48.73 61.97,48.73 70.3,40.4 RN8.7
A10
  Top 0.203: IC2.32 50.61,49.36 62.13,49.36 64.9,46.59 65.14,46.35 71.1,40.39 RN8.6
A11
  Top 0.203: IC2.34 51.38,51.27 52.6,51.27 53.87,50 62.27,50 71.9,40.38 RN8.5
A12
  Top 0.203: IC2.35 51.45,51.9 52.92,51.9 54.19,50.63 62.44,50.63 73.62,39.45 RN9.8
A13
  Top 0.203: IC2.36 51.52,52.54 53.24,52.54 54.43,51.35 62.52,51.35 74.43,39.44 RN9.7
BD0
  Top 0.305: RN1.1 17.43,14.67 14.5,11.74 14.5,6.65 J1.A31
BD1
  Top 0.305: RN1.2 18.23,13.56 17.04,12.37 17.04,6.65 J1.A30
BD2
  Top 0.305: RN1.3 19.03,13.65 19.58,13.1 19.58,6.65 J1.A29
BD3
  Top 0.305: J1.A28 22.12,6.66 22.12,12.69 19.83,14.98 RN1.4
BD4
  Top 0.305: J1.A27 23.34,7.87 24.66,9.19 24.66,11.42 22.83,13.26 RN2.1
BD5
  Top 0.305: RN2.2 23.63,13.73 24.66,12.69 25.93,12.69 27.2,11.42 27.2,10.15 27.2,6.66 J1.A26
BD6
  Top 0.305: RN2.3 24.33,15.47 24.33,14.29 24.98,13.64 26.56,13.64 27.83,12.37 28.79,12.37 29.74,11.42 29.74,6.65 J1.A25
BD7
  Top 0.305: J1.A24 32.28,6.65 32.28,11.74 30.69,13.33 28.47,13.33 27.4,14.39 25.82,14.39 25.29,14.91 25.29,15.49 RN2.4
D0
  Top 0.203: IC2.2 37.74,41.58 22.28,41.58 17.43,36.73 RN3.8
D1
  Top 0.203: IC2.3 37.67,40.95 22.6,40.95 18.23,36.58 RN3.7
D2
  Top 0.203: IC2.4 37.6,40.31 22.91,40.31 19.03,36.43 RN3.6
D3
  Top 0.203: IC2.5 37.53,39.68 23.23,39.68 19.83,36.28 RN3.5
D4
  Top 0.203: IC2.6 37.46,39.04 23.55,39.04 21.56,37.05 RN4.8
D5
  Top 0.203: IC2.7 37.39,38.41 23.87,38.41 22.35,36.9 RN4.7
D6
  Top 0.203: IC2.8 37.33,37.77 24.18,37.77 23.07,36.66 23.07,35.47 RN4.6
D7
  Top 0.203: IC2.9 37.26,37.14 24.5,37.14 23.95,36.59 RN4.5
FOO
  Top 0.61: 17.99,61.27 14.18,65.08 14.18,58.73 arc180 26.88,58.73 26.88,65.08 23.07,61.27
GND  (via drill 0.6, 1.02 pad 1.78)
  Top 0.203: IC2.19 49.42,41.76 49.42,40.47 50.51,39.39 52.87,39.39 C21.2
  Top 0.305: IC4.4 64.51,23.52 v64.67,23.8 | IC4.45 64.51,28.05 v64.67,27.93 62.44,27.93 61.97,28.41 61.97,29.68 62.28,30 62.68,30 IC4.48 | IC4.39 67.51,27.93 | v70.06,27.93 70.01,28.13 IC4.34 | IC4.10 67.51,23.79 | IC4.15 70.01,23.72 | IC4.1 62.71,22.22 v61.49,22.22 | USB_DEVICE.GND 38.07,74.6 35.77,74.6 34.5,75.87 | 34.5,75.87 33.99,75.87 | 34.5,75.87 35.9,77.27 USB_DEVICE.MT2 USB_DEVICE.P$2 USB_DEVICE.P$1 | USB_DEVICE.MT1 43.9,77.14 | RESET.1 23.64,71.81 v23.07,72.38 | IC4.21 IC4.22 IC4.23 IC4.24 75.12,21.92 v75.78,21.26 | IC4.28 73.01,27.84 73.24,27.61 | IC4.25 74.51,27.93 74.82,27.61 | IC3.45 19.74,28.09 v19.9,27.93 | IC3.39 22.76,29.66 v22.76,27.93 | IC3.34 25.24,28.2 v24.98,27.93 | IC3.28 28.24,27.84 28.47,27.61 30.06,27.61 | 30.06,27.61 31.01,27.61 v31.8,28.41 31.96,28.57 | IC3.25 29.74,27.93 30.06,27.61 | IC3.4 19.74,23.65 v19.9,23.8 | IC3.10 22.74,23.79 v22.76,23.8 | IC3.24 30.67,21.92 30.69,21.9 v31.01,22.22 | IC3.21 28.24,23.58 v28.47,23.8 | v25.29,23.8 25.24,23.75 IC3.15 25.24,21.26 | R10.1 33.77,20.41 v33.71,20.47 | Q2.2 42.29,29.98 v41.81,30.47 | 49.91,29.98 48.64,29.98 v48.16,30.47 | C5.- C4.- 13.23,42.85 13.23,47.62 12.91,47.93 | BOOTSEL.1 14.75,71.81 v14.18,72.38 | C1.2 v84.03,30.15
  Top 0.406: Q1.2 49.91,29.98 | IC2.60 IC2.63 | v67.52,27.93 67.51,27.93 | 67.51,23.79 v67.52,23.8 | v70.06,23.8 70.01,23.72 | 43.9,77.14 v45.3,75.56 | 33.99,75.87 v31.65,75.87 | 73.24,27.61 74.82,27.61 75.46,27.61 75.78,27.93 v75.78,29.84 | LED1.C 44.22,77.46 USB_DEVICE.MT1 | U1.4 35.77,51.11 v35.61,50.95 | GPIO.6 68.79,70.79 70.81,68.78 MICROSD.G2 81.49,68.78 | 81.49,68.78 84.54,68.78 MICROSD.G1 87.84,66.97 87.84,60 86.57,58.73 | MICROSD.6 81.24,68.52 81.49,68.78
  Top 0.61: 10.37,47.93 U2.2 v7.52,47.93 | 10.37,47.93 12.91,47.93 | C3.2 10.37,51.35 10.37,47.93 | C28.2 C26.2 37.12,42.85 v36.73,42.85 | C21.2 C22.2 57.6,39.92 v58,40.31 | C17.2 C10.2 C15.2 45.14,56.59 v45.14,56.82 | C25.2 40.85,56.27 v40.85,56.82 | C12.2 76.73,22.22 v75.78,21.26 | C20.2 75.78,29.6 v75.78,29.84 | C29.- 86.57,58.73 89.11,58.73 90.38,57.46 v90.38,55.55 v90.38,53.01 v90.38,50.47
  Top 0.813: C2.- v10.37,30.15
  Bottom 0.203: C24.2 C23.2 50.3,32.62 v48.16,30.47 | C19.2 42.44,44.98 | 42.76,48.04 C16.2 | C18.2 51.3,47.57 | SWD.1 78.32,39.04 59.27,39.04
  Bottom 0.305: J1.C1 J1.A1 89.43,5.29 89.43,3.8 88.16,2.53 28.15,2.53 27.2,3.48 27.2,7.61 25.88,8.93 J1.C26 | C7.2 69.67,26.51 | 69.67,26.51 69.67,27.85 69.74,27.93 | 76.02,23.8 76.09,23.8 76.09,21.58 v75.78,21.26 | v31.01,22.22 31.01,22.53 | 31.01,22.53 31.01,23.8 | 23.31,24.83 C13.2 23.47,25.07 | v33.71,20.47 31.65,22.53 31.01,22.53 | 69.35,26.51 69.67,26.51 | 5.61,47.93 5.29,47.62 | GPIO.6 59.9,75.87 | IC2.64 IC2.65 | IC2.65 | IC2.65 IC2.66 | IC2.65 IC2.62 | IC2.62 | IC2.58 IC2.59 | IC2.59 | IC2.59 IC2.60 | IC2.62 | IC2.62 IC2.59 | IC2.62 IC2.61 | IC2.62 IC2.63 | v84.03,30.15 84.03,25.39
  Bottom 0.406: v70.06,27.93 69.74,27.93 | 68.08,23.8 67.92,23.8 v67.52,23.8 | 76.02,23.8 77.6,23.8 | v45.3,75.56 50.06,75.56 50.22,75.4 50.22,74.13 51.96,75.87 59.9,75.87 | v31.65,75.87 23.07,75.87 | 23.07,75.87 14.5,75.87 | 14.5,75.87 12.91,75.87 11.64,74.6 11.64,66.98 10.37,65.71 BOOTRST.1 | v23.07,72.38 23.07,75.87 | v14.18,72.38 14.18,75.56 14.5,75.87 | 75.78,27.93 v75.78,29.84
  Bottom 0.61: 32.28,27.93 v24.98,27.93 24.34,27.93 | 24.34,27.93 v22.76,27.93 v19.9,27.93 16.8,27.93 | J1.C4 J1.C3 86.26,12.37 87.42,12.37 J1.C1 89.43,10.46 89.43,25.39 84.03,25.39 79.59,25.39 | 50.22,74.13 49.42,73.33 49.42,66.98 46.25,63.81 7.2,63.81 6.56,63.17 | 61.17,27.93 v64.67,27.93 v67.52,27.93 v70.06,27.93 75.78,27.93 77.05,27.93 79.59,25.39 | J1.C26 28.79,13.33 33.55,13.33 44.03,23.8 | 61.49,23.8 v64.67,23.8 v67.52,23.8 | 76.02,23.8 v70.06,23.8 68.08,23.8 | 79.59,25.39 78,23.8 76.09,23.8 | 6.56,63.17 5.29,61.9 5.29,47.62 5.29,28.88 7.83,26.34 v10.37,26.34 10.37,27.61 | v61.49,22.22 61.49,23.8 | 61.17,27.93 60.62,27.37 C9.2 | 67.92,23.8 C14.2 69.35,26.51 | 16.72,23.8 v19.9,23.8 v22.76,23.8 24.34,23.8 | 24.34,23.8 v25.29,23.8 v28.47,23.8 31.01,23.8 31.96,23.8 | 31.96,23.8 32.2,24.04 C11.2 | C8.2 15.85,26.98 16.8,27.93 | 23.31,24.83 24.34,23.8 | 24.34,27.93 24.34,26.74 C6.2 23.47,25.07 | 32.28,27.93 38.95,27.93 | 38.95,27.93 41.81,27.93 | 41.81,27.93 48.16,27.93 | 48.16,27.93 61.17,27.93 | 38.95,27.93 39.58,27.3 39.58,24.44 40.22,23.8 | v31.8,28.41 32.28,27.93 | v41.81,30.47 41.81,27.93 | v48.16,30.47 48.16,27.93 | v7.52,47.93 5.61,47.93 | BOOTRST.1 6.56,63.17 | v10.37,30.15 10.37,27.61 | v35.61,50.95 34.82,50.16 C27.2 | 42.44,44.98 IC2.58 | v36.73,42.85 37.99,44.12 37.99,46.03 38.63,46.66 IC2.58 | IC2.58 42.76,48.04 | C16.2 38.24,48.33 v35.61,50.95 | IC2.63 51.3,47.57 53.76,47.57 57.2,44.12 57.2,41.11 v58,40.31 59.27,39.04 61.17,37.14 61.17,27.93 | v35.61,50.95 35.61,54.13 38.31,56.82 v40.85,56.82 v45.14,56.82 | 61.49,23.8 44.03,23.8 | 44.03,23.8 40.22,23.8 | 40.22,23.8 31.96,23.8 | 16.8,27.93 10.69,27.93 10.37,27.61
  Bottom 0.813: v10.37,26.34 10.37,23.17 | 10.37,23.17 12.28,21.26 14.18,21.26 16.72,23.8 | J1.C26 25.88,10.75 23.59,13.04 14.79,13.04 10.37,17.45 10.37,23.17
  other vias: 22.44,58.73 18.63,58.73 31.96,32.69 35.77,32.69 35.77,19.36 59.9,20.63 56.73,20.63 56.73,32.69 59.9,29.52 81.49,21.26 81.49,32.06 71.97,66.35 87.21,66.35 77.68,74.6 81.49,74.6 47.84,61.9 45.3,68.89 37.04,68.89 37.04,61.9 30.69,42.85 16.72,31.42 18.63,42.85 12.91,32.69 12.91,37.77 12.28,40.31 9.74,40.31 9.1,53.65 8.47,45.39 10.37,45.39 4.02,45.39 14.18,19.99 10.37,13.64 4.02,23.8 60.54,40.31 51.65,39.68 30.53,17.14 56.09,73.97 77.68,32.06 71.33,47.3 12.28,45.39 8.47,51.11
  pour Top (isolate 0.305): 99.27,0.31 1.48,0.31 1.48,79.68 99.27,79.68
  pour Bottom (isolate 0.305): 0.21,-0.33 0.21,77.14 2.75,79.68 98,79.68 98,-0.33
HIRQ
  Top 0.203: IC2.12 43.88,42.07 43.88,34.13 R9.2
HRST
  Top 0.203: IC2.13 44.37,41.99 44.37,36.8 45.3,35.87 48.47,35.87 50.06,34.28 R7.2
LA2  (via drill 0.6)
  Top 0.305: v55.14,15.55 55.14,6.65 J1.A15 | IC4.5 65.01,18.43 61.49,14.91 v57.36,14.91
  Bottom 0.305: v55.14,15.55 55.77,14.91 v57.36,14.91
LA3
  Top 0.305: J1.A14 57.68,6.65 57.68,12.37 58.95,13.64 61.81,13.64 65.51,17.35 IC4.6
LA4
  Top 0.305: J1.A13 60.22,6.65 60.22,11.42 61.49,12.69 62.55,12.69 66.51,16.77 IC4.8
LA5
  Top 0.305: J1.A12 62.76,6.65 62.76,11.42 67.01,15.67 IC4.9
LA6
  Top 0.305: J1.A11 65.3,6.65 65.3,12.37 68.01,15.08 IC4.11
LA7
  Top 0.305: J1.A10 67.84,6.65 67.84,13.33 68.51,14 IC4.12
LA8
  Top 0.305: J1.A9 70.38,6.65 70.38,13.64 69.01,15.01 IC4.13
LA9
  Top 0.305: J1.A8 72.92,6.65 72.92,12.69 69.51,16.1 IC4.14
LA10
  Top 0.305: J1.A7 75.46,6.65 75.46,11.74 70.51,16.69 IC4.16
LA11
  Top 0.305: J1.A6 78,6.65 78,12.06 77.37,12.69 76.09,12.69 71.01,17.78 IC4.17
LA12
  Top 0.305: J1.A5 79.53,5.33 80.54,6.34 80.54,12.06 78.63,13.96 76.41,13.96 72.01,18.36 IC4.19
LA13
  Top 0.305: J1.A4 83.08,6.65 83.08,12.06 79.9,15.23 76.73,15.23 72.51,19.45 IC4.20
N$1
  Top 0.203: R1.1 42.76,60.79 42.76,51.25 IC2.47
N$2
  Top 0.203: R2.1 44.03,61.43 43.39,60.8 43.39,51.18 IC2.46
N$3
  Top 0.305: USB_DEVICE.D+ 39.9,68.09 41.33,66.66 R1.2
N$4
  Top 0.305: R2.2 44.03,64.92 40.53,68.41 40.53,75.11 USB_DEVICE.D-
N$5
  Top 0.203: IC2.52 38.71,52.48 30.54,52.48 29.82,51.76 29.82,50.47 30.46,49.84 U1.6
N$6
  Top 0.203: IC2.53 38.71,51.9 32.05,51.9 U1.5
N$7
  Top 0.203: IC2.51 38.73,53.01 30.38,53.01 29.26,51.9 29.26,49.6 30.3,48.57 U1.7
N$8
  Top 0.203: U1.3 39.16,49.89 40.16,49.89 IC2.54
N$9
  Top 0.203: IC2.55 40.92,48.57 U1.2
N$10
  Top 0.305: RN10.5 70.63,61.34 71.97,60 77.05,60 80.14,63.09 MICROSD.5
N$11  (via drill 0.6)
  Top 0.203: U1.1 37.8,47.26 IC2.56
  Top 0.305: U1.1 35.3,47.3 33.23,49.36 v33.23,50 | 31.96,58.09 v31.96,55.4 | R13.1 32.44,57.62 31.96,58.09 | R3.2 31.96,58.09
  Bottom 0.305: v33.23,50 31.96,51.27 v31.96,55.4
N$12  (via drill 0.6)
  Top 0.305: BOOTRST.2 7.83,68.25 9.74,70.16 17.36,70.16 | v21.8,67.78 29.26,67.78 31.96,65.08 R3.1 | 17.36,70.16 19.01,71.81 BOOTSEL.3 BOOTSEL.4 | 17.36,70.16 v17.99,69.52
  Bottom 0.305: v21.8,67.78 20.06,69.52 v17.99,69.52
N$13  (via drill 0.6)
  Top 0.203: IC2.21 51.21,41.11 v51.65,41.11
  Bottom 0.203: R5.2 53.08,41.11 v51.65,41.11
N$14
  Top 0.305: MICROSD.2 76.84,64.87 75.71,63.74 RN10.8
N$15  (via drill 0.6)
  Top 0.203: IC2.25 50.61,43.97 59.9,43.97 60.7,43.17 v62.6,43.17
  Top 0.305: v74.67,43.17 80.7,43.17 82.45,41.43 SWD.2
  Bottom 0.305: v62.6,43.17 v74.67,43.17
N$16  (via drill 0.6)
  Top 0.203: IC2.24 50.68,43.33 58.95,43.33 60.22,42.06 v63.71,42.06
  Top 0.305: v75.94,41.9 79.43,38.41 83.56,38.41 84.98,39.84 SWD.3
  Bottom 0.305: v63.71,42.06 75.78,42.06 v75.94,41.9
N$17
  Bottom 0.203: R5.1 55.61,39.84 54.82,39.04 | 54.82,39.04 54.82,37.16 X1.2 | C24.1 54.74,38.97 54.82,39.04
N$18
  Top 0.305: Q1.1 R7.1
N$19  (via drill 0.6)
  Top 0.203: IC2.20 50.54,41.21 v50.54,40.47
  Bottom 0.203: v50.54,40.47 50.54,39.18 X1.1 48.5,33.7 C23.1
N$20
  Top 0.305: R9.1 Q2.1
N$21
  Top 0.305: IC3.47 18.74,31.31 17.67,32.38 17.67,33.89 RN3.1
N$22
  Top 0.305: IC3.14 24.74,20.23 25.29,19.68 25.93,19.68 | R10.2 30.06,19.04 29.42,19.68 29.26,19.68 | 25.93,19.68 26.41,19.68 | 26.41,19.68 27.36,19.68 | 27.36,19.68 27.83,19.68 | 27.83,19.68 28.79,19.68 | 28.79,19.68 29.26,19.68 | IC3.16 25.74,19.86 25.93,19.68 | IC3.17 26.24,19.84 26.41,19.68 | IC3.19 27.24,19.79 27.36,19.68 | IC3.20 27.74,19.77 27.83,19.68 | IC3.22 28.74,19.72 28.79,19.68 | IC3.23 29.24,19.7 29.26,19.68
N$23
  Top 0.305: MICROSD.3 77.94,64.06 75.14,61.27 71.97,61.27 71.1,62.14 RN10.6
N$24  (via drill 0.6)
  Top 0.305: RN10.7 74.11,62.94 v74.51,62.54 | MICROSD.7 82.34,63.54 | v80.06,61.27 82.34,63.54 | 83.34,62.54 82.34,63.54
  Top 0.406: R4.1 83.34,62.54
  Bottom 0.305: v74.51,62.54 78.79,62.54 v80.06,61.27
N$25  (via drill 1.02 pad 1.78)  (2 unrouted)
  other vias: 87.84,55.55 87.84,53.01 87.84,50.47
N$26
  Top 0.406: R11.1 52.76,74.29 LED1.A
N$27
  Top 0.305: IC3.46 19.24,31.76 18.23,32.78 RN3.2
N$28  (via drill 0.6)
  Top 0.203: IC2.37 53.97,55.55 v54.66,55.55 | v52.44,57.78 51.01,59.21 R11.2
  Bottom 0.203: v54.66,55.55 v52.44,57.78
N$29
  Top 0.305: IC3.32 26.29,29.72 26.29,31.49 28.08,33.28 RN5.4
N$30
  Top 0.305: IC3.44 20.24,32.03 19.26,33.01 19.26,33.9 RN3.3
N$31
  Top 0.305: IC3.43 20.74,32.8 19.83,33.72 RN3.4
N$32
  Top 0.305: IC3.40 22.24,32.82 22.35,32.93 RN4.2
N$33
  Top 0.305: IC3.41 21.74,33.95 RN4.1
N$34
  Top 0.305: RN4.3 23.24,34.05 IC3.38
N$35
  Top 0.305: IC3.37 23.74,33.05 23.95,33.26 RN4.4
N$36
  Top 0.305: IC3.36 24.24,32.28 25.68,33.72 RN5.1
N$37
  Top 0.305: IC3.35 24.74,31.82 26.48,33.56 RN5.2
N$38
  Top 0.305: IC3.33 25.74,31.87 27.28,33.41 RN5.3
N$39
  Top 0.305: IC4.47 63.51,31.31 61.24,33.58 RN6.1
N$40
  Top 0.305: IC4.46 64.01,31.76 62.04,33.73 RN6.2
N$41
  Top 0.305: IC4.44 65.01,31.71 62.76,33.96 62.76,34.53 RN6.3
N$42
  Top 0.305: RN6.4 63.64,34.03 65.51,32.17 IC4.43
N$43
  Top 0.305: IC4.41 66.51,32.44 65.37,33.58 RN7.1
N$44
  Top 0.305: IC4.40 67.01,32.89 66.17,33.73 RN7.2
N$45
  Top 0.305: IC4.38 68.01,32.84 66.97,33.88 RN7.3
N$46
  Top 0.305: IC4.37 68.51,33.29 67.77,34.03 RN7.4
N$47
  Top 0.305: IC4.36 69.01,33.23 69.5,33.72 RN8.1
N$48
  Top 0.305: IC4.35 69.51,32.78 70.3,33.56 RN8.2
N$49
  Top 0.305: IC4.33 70.51,32.82 71.1,33.41 RN8.3
N$50
  Top 0.305: IC4.32 71.01,32.37 71.9,33.26 RN8.4
N$51
  Top 0.305: IC4.30 72.01,32.42 73.62,34.03 RN9.1
N$52
  Top 0.305: IC4.29 72.51,31.97 74.43,33.88 RN9.2
N$53
  Top 0.305: IC4.27 73.51,32.01 75.23,33.73 RN9.3
N$54
  Top 0.305: IC4.26 74.01,31.56 76.02,33.58 RN9.4
N$56  (via drill 1.02 pad 1.78)  (2 unrouted)
  other vias: 85.3,55.55 85.3,53.01 85.3,50.47
N$57  (via drill 1.02 pad 1.78)  (2 unrouted)
  other vias: 82.76,55.55 82.76,53.01 82.76,50.47
N$58  (via drill 1.02 pad 1.78)  (2 unrouted)
  other vias: 80.22,55.55 80.22,53.01 80.22,50.47
N$59  (via drill 1.02 pad 1.78)  (2 unrouted)
  other vias: 77.68,55.55 77.68,53.01 77.68,50.47
N$60  (via drill 1.02 pad 1.78)  (2 unrouted)
  other vias: 75.14,55.55 75.14,53.01 75.14,50.47
N$61  (via drill 1.02 pad 1.78)  (2 unrouted)
  other vias: 72.6,55.55 72.6,53.01 72.6,50.47
N$62  (via drill 1.02 pad 1.78)  (2 unrouted)
  other vias: 70.06,55.55 70.06,53.01 70.06,50.47
NIORD
  Top 0.305: J1.C15 53.82,16.23 55.36,17.77 61.17,17.77 63.51,20.11 IC4.2
NIOWR
  Top 0.305: J1.C14 56.36,15.82 57.05,16.5 61.49,16.5 64.01,19.02 IC4.3
NPIRQ
  Top 0.305: J1.C16 51.28,13.69 45.61,19.36 R8.1 45.93,22.85 45.93,26.34 44.66,27.61 Q2.3
NPS  (via drill 0.6)
  Top 0.305: J1.C22 36.04,13.37 34.18,15.23 30.06,15.23 v27.52,17.77 26.22,17.77 24.24,19.75 IC3.13 | IC3.48 17.77,29.2 v16.72,29.2 | v14.18,29.2 13.86,28.88 v13.86,26.03 | v16.73,21.89 16.1,21.89 14.5,23.49 v13.86,23.49
  Bottom 0.305: v16.72,29.2 v14.18,29.2 | v16.73,21.89 17.37,21.89 21.49,17.77 v27.52,17.77 | v13.86,26.03 v13.86,23.49
NRD
  Top 0.203: IC2.14 45.34,40.59 49.74,36.19 55.93,36.19 55.94,36.18 60.92,36.18 RN6.8
NRST  (via drill 0.6)
  Top 0.305: Q1.3 51.01,22.53 R6.1 51.33,16.82 v52.6,15.55
  Bottom 0.305: J1.C12 61.44,11.68 59.48,13.64 54.5,13.64 v52.6,15.55
NSEL
  Top 0.203: IC2.11 43.39,42.14 43.39,40.95 42.44,40 40.9,40 37.39,36.49 25.92,36.49 25.68,36.26 RN5.8
NWR
  Top 0.203: RN6.7 61.97,35.94 61.97,36.35 61.49,36.82 49.88,36.82 46.52,40.17 IC2.15
PRNW  (via drill 0.6)
  Top 0.305: v52.6,8.09 36.25,8.09 34.82,9.52 34.82,11.9 32.44,14.28 29.1,14.28 v27.52,15.87 | v17.36,19.99 17.36,20.4 18.24,21.28 IC3.1
  Bottom 0.305: v52.6,8.09 57.2,8.09 58.9,9.79 J1.C13 | v27.52,15.87 26.56,16.82 21.17,16.82 17.99,19.99 v17.36,19.99
RUN  (via drill 0.6)
  Top 0.203: IC2.26 50.57,44.58 61.2,44.58 v61.49,44.28
  Top 0.305: C1.1 87.45,33.57 R12.1 87.52,35.23 SWD.4 87.52,42.38 85.62,44.28 v73.56,44.28 | RESET.3 RESET.4 | v30.53,77.3 28.88,77.3
  Top 0.406: 28.88,77.3 RESET.4
  Bottom 0.305: v61.49,44.28 v73.56,44.28 | 92.92,73.33 92.92,46.03 SWD.4
  Bottom 0.406: 31.01,77.78 88.79,77.78 92.92,73.33 | 31.01,77.78 11.64,77.78 6.56,72.7 BOOTRST.3 | 31.01,77.78 v30.53,77.3
SCL
  Top 0.305: J1.C19 43.66,12.01 45.3,13.64 SCL.TP
SDA
  Top 0.305: J1.C20 41.12,12.1 39.58,13.64 SDA.TP
SPI_CS
  Top 0.203: IC2.41 55.46,59.3 55.46,66.98 56.73,68.25 GPIO.5
  Top 0.305: RN10.1 65.69,63.74 61.17,68.25 GPIO.5
SPI_RX
  Top 0.203: IC2.40 56.09,59.37 56.09,64.44 57.36,65.71 GPIO.4
  Top 0.305: RN10.2 64.58,62.94 61.81,65.71 GPIO.4
SPI_SCK
  Top 0.203: IC2.38 58.49,60.63 GPIO.2
  Top 0.305: RN10.4 65.63,61.34 64.92,60.63 GPIO.2
SPI_TX
  Top 0.203: IC2.39 56.73,59.44 56.73,61.9 58,63.17 GPIO.3
  Top 0.305: RN10.3 63.48,62.14 62.44,63.17 GPIO.3
TD0
  Top 0.305: RN1.8 17.43,18.09 18.74,19.4 IC3.2
TD1
  Top 0.305: RN1.7 18.23,18.01 19.24,19.02 IC3.3
TD2
  Top 0.305: RN1.6 19.03,17.85 20.24,19.07 IC3.5
TD3
  Top 0.305: IC3.6 20.74,18.68 19.83,17.76 RN1.5
TD4
  Top 0.305: IC3.8 21.74,18.47 22.83,17.38 RN2.8
TD5
  Top 0.305: IC3.9 22.24,18.92 23.63,17.54 RN2.7
TD6
  Top 0.305: IC3.11 23.24,18.87 24.42,17.69 RN2.6
TD7
  Top 0.305: IC3.12 23.74,19.32 25.22,17.84 RN2.5
V_USB  (via drill 0.6)
  Top 0.406: USB_DEVICE.VBUS 41.2,73.3 42.12,72.38
  Top 0.61: 42.12,72.38 v42.12,72.06 | v38.31,72.06 37.04,72.06 34.5,69.52 20.53,69.52 19.1,68.1 13.39,68.1 6.24,60.95 6.24,56.08 7.19,55.13 D2.1
  Bottom 0.61: v42.12,72.06 v38.31,72.06
VCCINT  (via drill 0.6)
  Top 0.203: C15.1 44.03,53.73 44.03,51.12 IC2.45 45.3,49.85 | 45.3,49.85 45.3,49.2 44.5,48.41 43.9,48.41 IC2.50 40.88,51.43 v40.88,52.04 | 45.3,49.85 46.09,49.85 48.95,46.98 48.95,46.51 48.16,45.71 48.16,45.29 IC2.23 50.75,42.7 54.5,42.7 55.46,41.74 C22.1
  Bottom 0.203: C16.1 40.88,51.95 v40.88,52.04

### Text on the board
Top: axio.ms
tDocu: Run | Gnd | Boot | P29 | Gnd | P28 | P27 | P26 | 3.3V | Gnd | 3.3V | v2 22 Oct 2021 | Gnd | SWDIO | SWCLK | Run | Arc Pipe Podule / (c) 2021 Matt Evans